# Altium schematic sheet pwm_channel.SchDoc
size A4; SheetNumber: 2; SheetTotal: 7; NameOfSheet: PWM channels
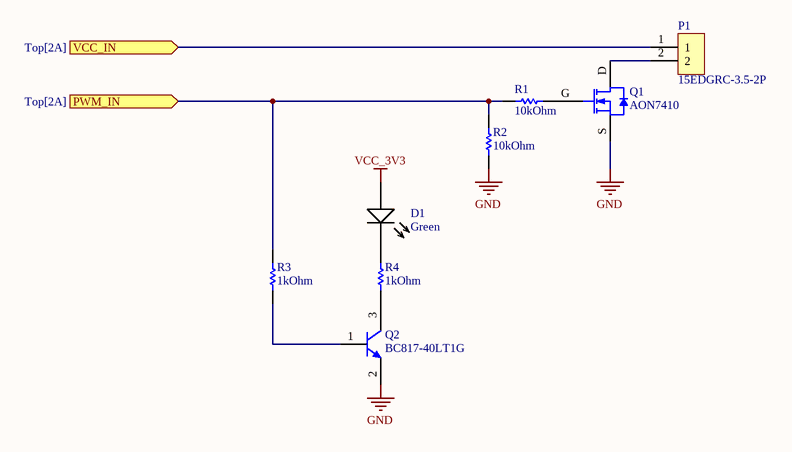
[diagram p0: pwm_channel.SchDoc]

## Parts
D1  Colour: Green  [LED_0603]  (hidden comment: C205450)
P1  15EDGRC-3.5-2P  [15EDGRC-3.5 - 2 pin]
Q1  AON7410  [DFN3x3_8L]
Q2  BC817-40LT1G  [SOT-23A]
R1  Resistance: 10kOhm  [RES_0603]  (hidden comment: 0603 10kOhm 1%)
R2  Resistance: 10kOhm  [RES_0603]  (hidden comment: 0603 10kOhm 1%)
R3  Resistance: 1kOhm  [RES_0603]  (hidden comment: 0603 1kOhm 1%)
R4  Resistance: 1kOhm  [RES_0603]  (hidden comment: 0603 1kOhm 1%)

## Ports
PWM_IN (in, see Top[2A]), VCC_IN (in, see Top[2A])

## Nets
GND: Q1.S Q2.2(E) R2.2
VCC_3V3: D1.A
PWM_IN: R1.2 R2.1 R3.2 ; port PWM_IN
VCC_IN: P1.1 ; port VCC_IN
NetD1_C: D1.C R4.2
NetP1_2: P1.2 Q1.D
NetQ1_G: Q1.G R1.1
NetQ2_1: Q2.1 R3.1
NetQ2_3: Q2.3(C) R4.1

## Notes on the sheet
- Author:
- Sheet:
- /
- Issue date:
- Project name:
- Revision:
- Date:
- Page name:

## Library data of the parts
D1 = LED diode: Generic LED diode SMD Green; Forward current: 0mA; Forward Voltage: 0V; Manufacturer Part Number: C205450; Supplier 1: LCSC; Supplier Part Number 1: C205450
P1 = 15EDGRC-3.5-2P: 15EDGRC-3.5 - 2 pin; Manufacturer Part Number: 15EDGRC-3.5-2P; Supplier 1: LCSC; Supplier Part Number 1: C61791
Q1 = AON7410: Tranzystor MOSFET kanał N; Supplier 1: LCSC; Supplier Part Number 1: C269266
Q2 = BC817-40LT1G: General Purpose Transistor, NPN Silicon, 3-Pin SOT-23, Pb-Free, Tape and Reel; Manufacturer: On Semiconductor; fT Min (MHz): 100; IC Continuous (A): 0.5; ComponentLink2URL: http://www.onsemi.com/pub_link/Collateral/BC817-16LT1-D.PDF; DatasheetVersion: Rev. 12; ComponentLink3URL: http://www.onsemi.cn/pub_link/Collateral/318-08.PDF; ComponentLink3Description: Package Specification; ComponentLink1Description: Manufacturer URL; Mounting Technology: Surface Mount; ComponentLink1URL: http://www.onsemi.com/; Packing: Tape and Reel; ComponentLink2Description: Datasheet; Polarity: NPN; RoHS: TRUE; PackageVersion: Rev. AP, 11/2009; PartNumber: BC817-40LT1G; PackageDescription: 3-Pin Small Outline Transistor, Body 2.92 x 1.3 mm, Pitch 0.95 mm; PackageReference: SOT-23-3-318-08; Supplier 1: LCSC; Supplier Part Number 1: C94412
R1-R4 = Resistor SMD_1: Generic Resistor SMD; Supplier 1: LCSC
  R1 R2: Manufacturer Part Number: 0603 10kOhm 1%; Supplier Part Number 1: C3017715
  R3 R4: Manufacturer Part Number: 0603 1kOhm 1%; Supplier Part Number 1: C3016283